# Altium schematic sheet Sheet1.SchDoc
size A2
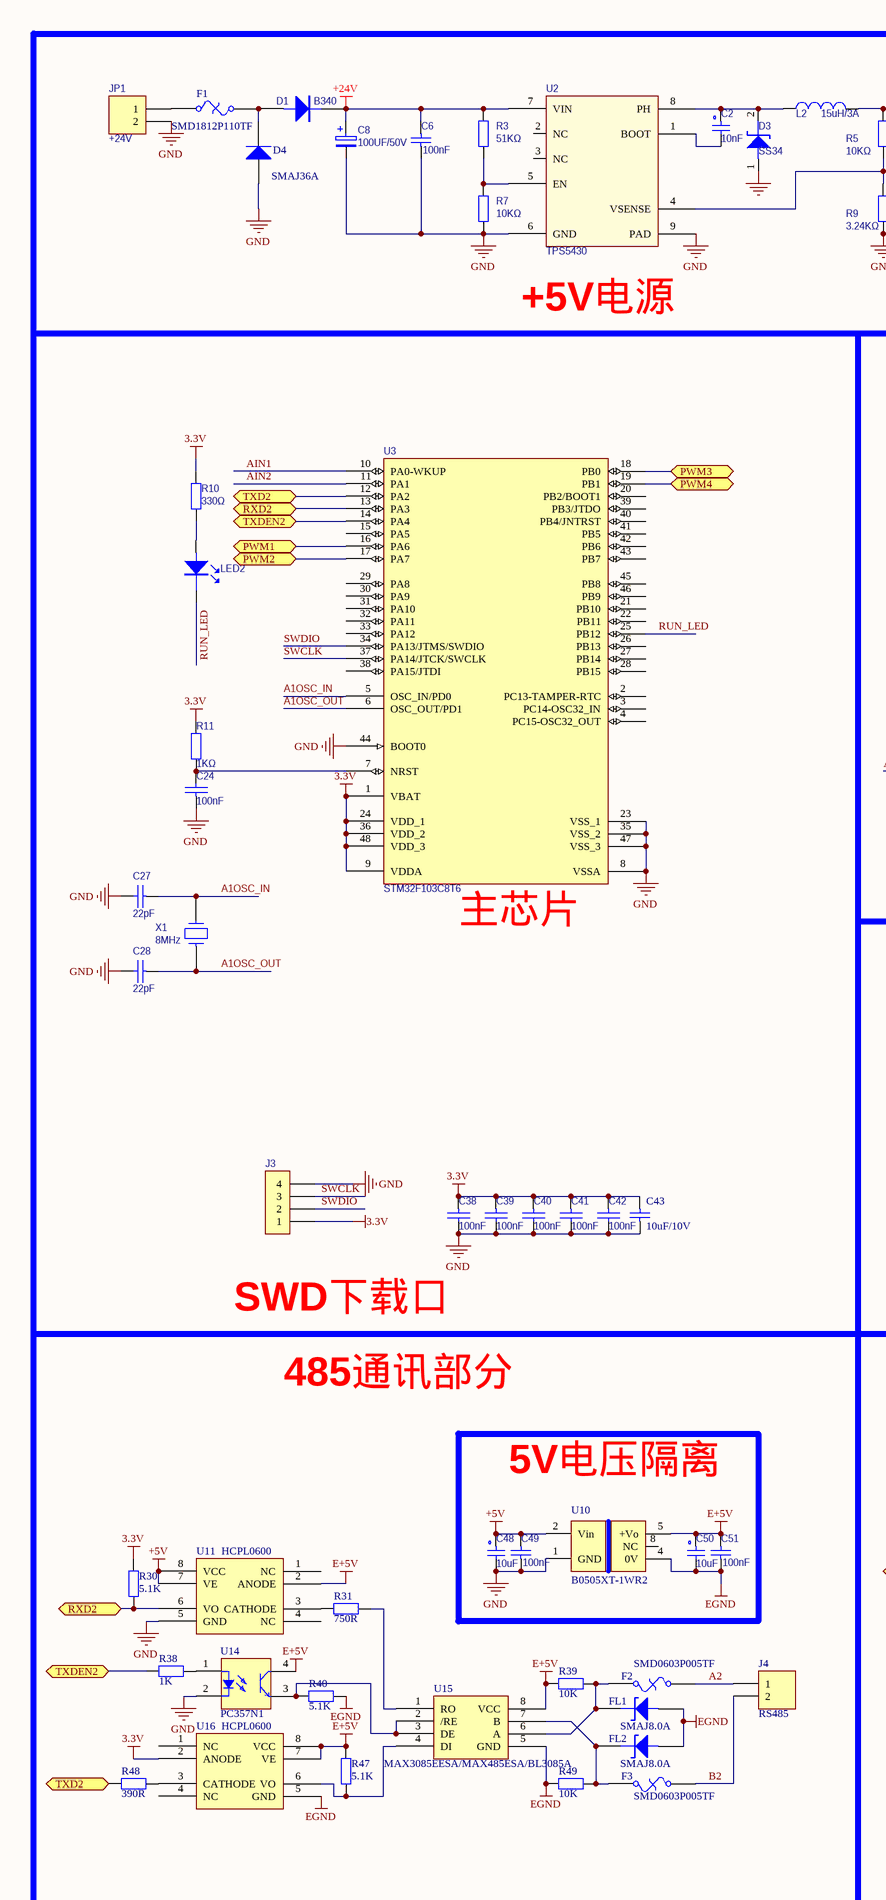
[diagram p0: Sheet1.SchDoc, left]
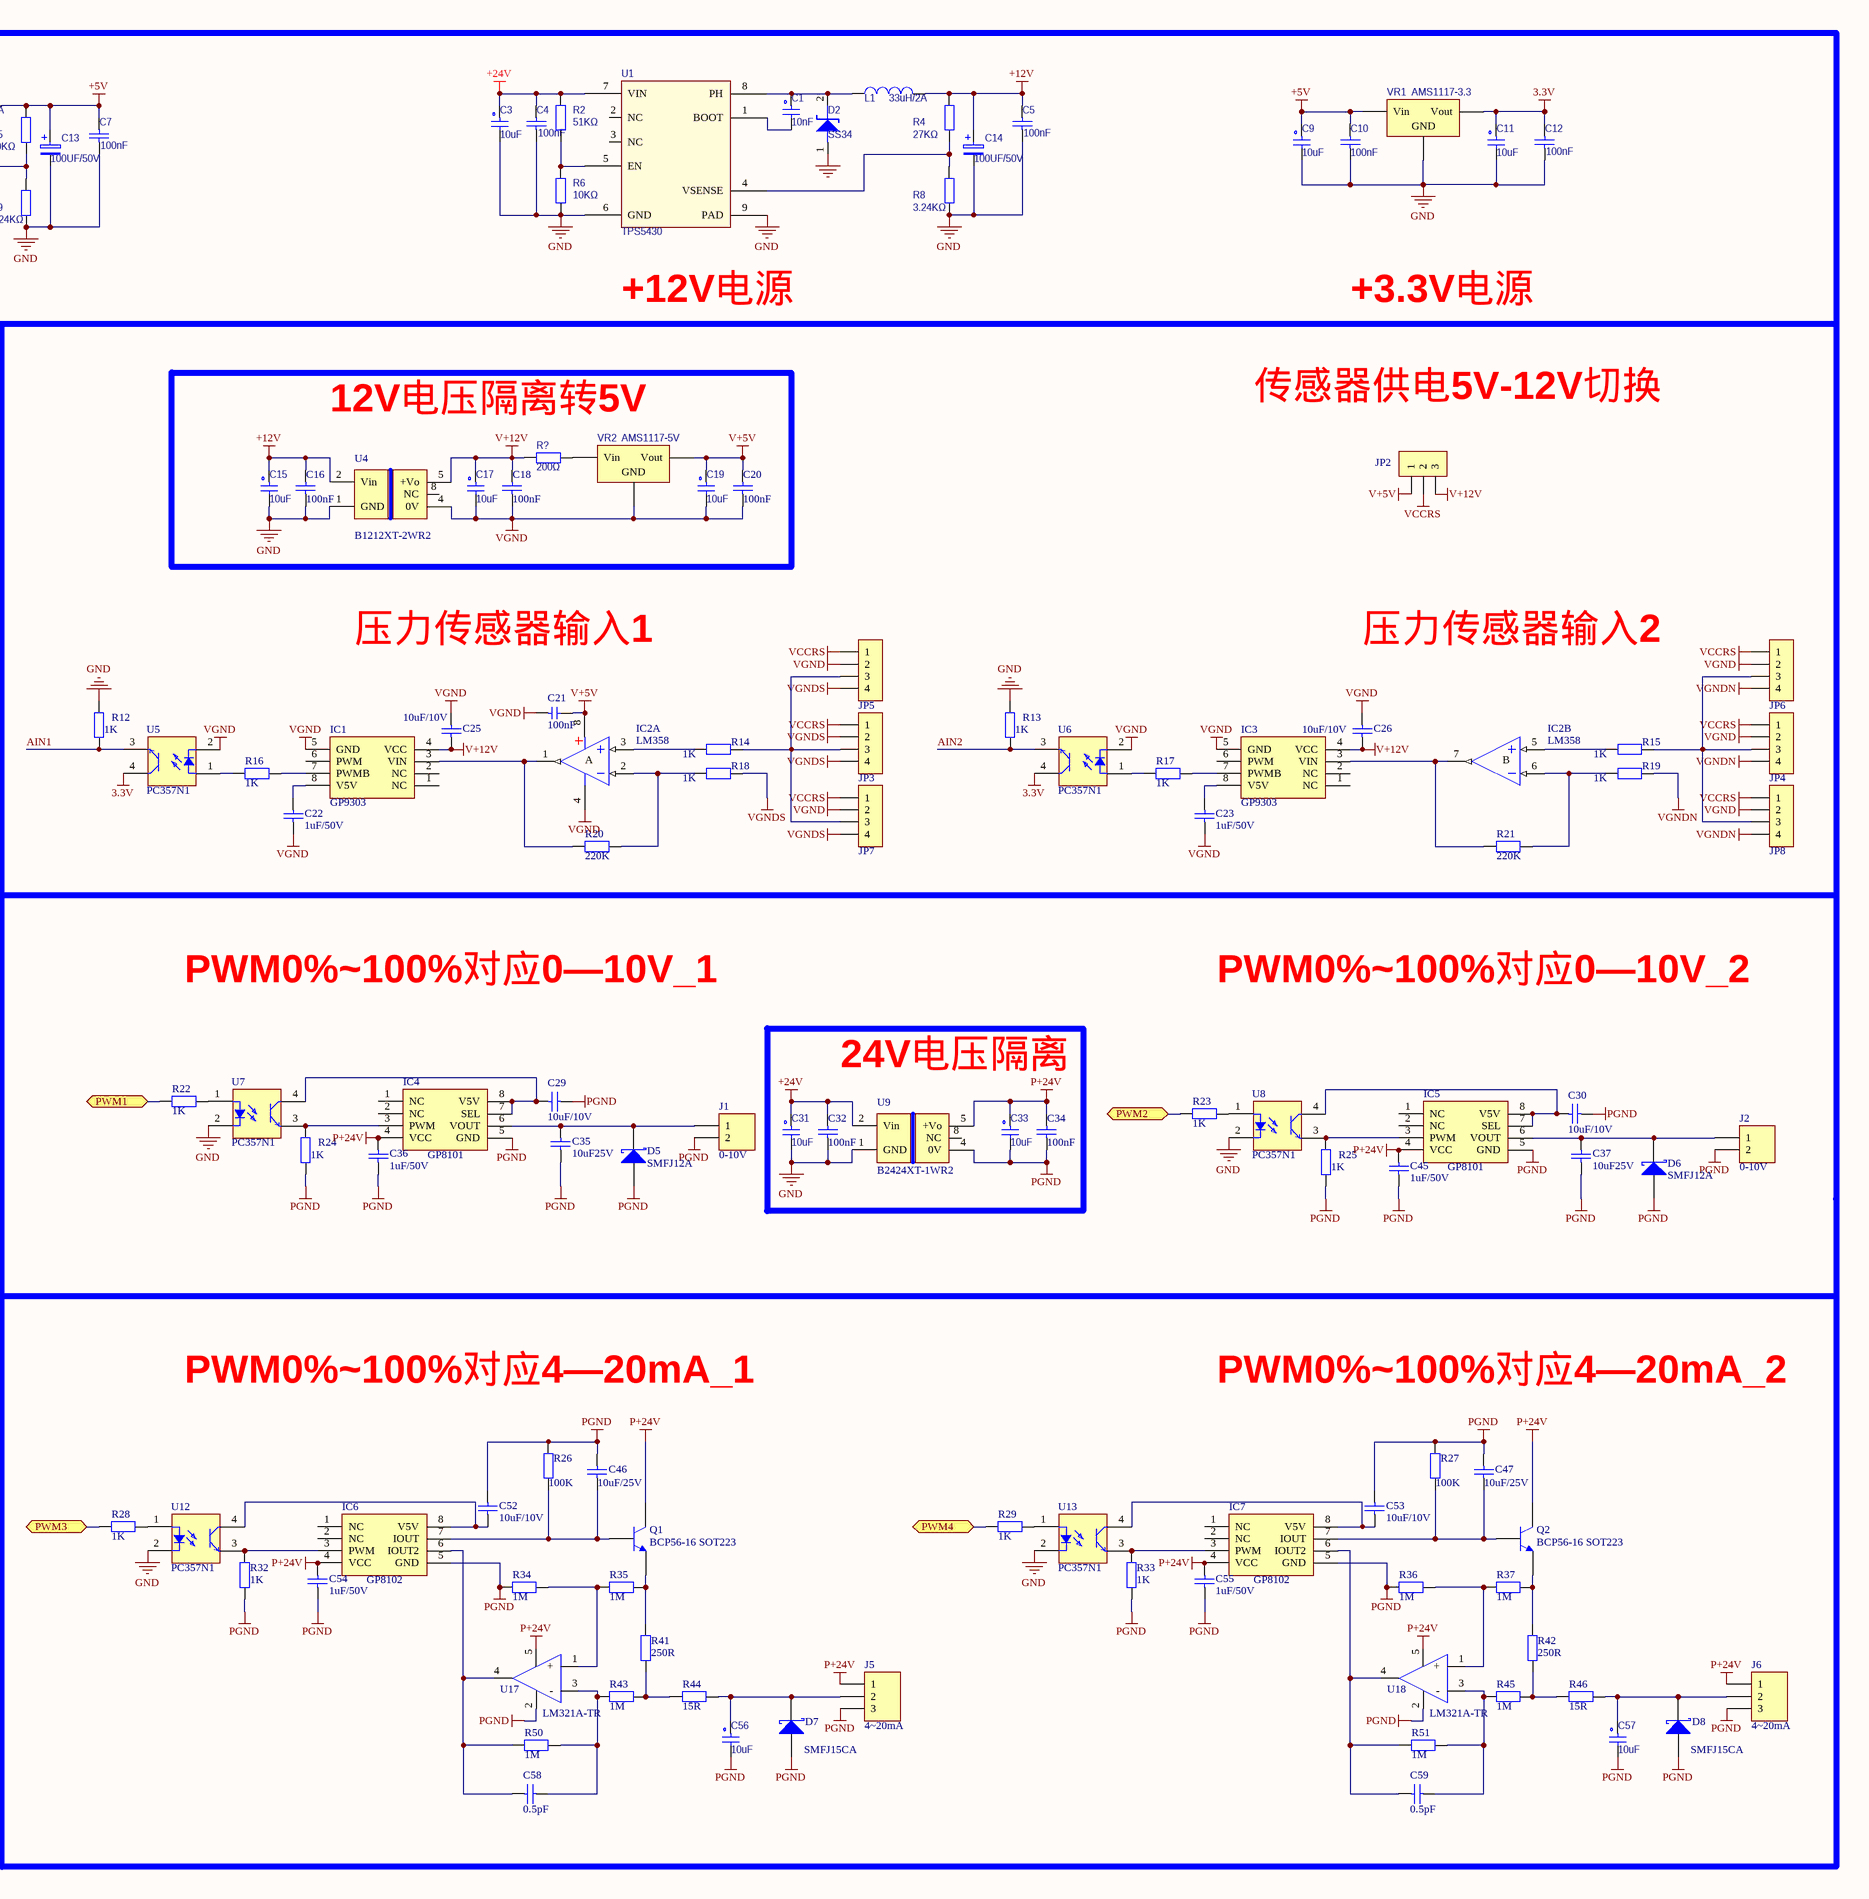
[diagram p1: Sheet1.SchDoc, right]

## Parts
C1  10nF  [SC0603]
C2  10nF  [SC0603]
C3  10uF  [C 1206_M]
C4  100nF  [C 0603_M]
C5  100nF  [C 0603_M]
C6  100nF  [C 0603_M]
C7  100nF  [C 0603_M]
C8  100UF/50V  [CM E(8*10.2)]
C9  10uF  [C 1206_M]
C10  100nF  [C 0603_M]
C11  10uF  [C 1206_M]
C12  100nF  [C 0603_M]
C13  100UF/50V  [CM E(8*10.2)]
C14  100UF/50V  [CM E(8*10.2)]
C15  10uF  [C 1206_M]
C16  100nF  [C 0603_M]
C17  10uF  [C 1206_M]
C18  100nF  [C 0603_M]
C19  10uF  [C 1206_M]
C20  100nF  [C 0603_M]
C21  100nF  [C 0603_M]
C22  1uF/50V  [C 0603_M]
C23  1uF/50V  [C 0603_M]
C24  100nF  [C 0603_M]
C25  10uF/10V  [C 0603_M]
C26  10uF/10V  [C 0603_M]
C27  22pF  [C 0603_M]
C28  22pF  [C 0603_M]
C29  10uF/10V  [C 0603_M]
C30  10uF/10V  [C 0603_M]
C31  10uF  [C 1206_M]
C32  100nF  [C 0603_M]
C33  10uF  [C 1206_M]
C34  100nF  [C 0603_M]
C35  10uF25V  [C 0603_M]
C36  1uF/50V  [C 0603_M]
C37  10uF25V  [C 0603_M]
C38  100nF  [C 0603_M]
C39  100nF  [C 0603_M]
C40  100nF  [C 0603_M]
C41  100nF  [C 0603_M]
C42  100nF  [C 0603_M]
C43  10uF/10V  [C 0603_M]
C45  1uF/50V  [C 0603_M]
C46  10uF/25V  [C 0603_M]
C47  10uF/25V  [C 0603_M]
C48  10uF  [C 1206_M]
C49  100nF  [C 0603_M]
C50  10uF  [C 1206_M]
C51  100nF  [C 0603_M]
C52  10uF/10V  [C 0603_M]
C53  10uF/10V  [C 0603_M]
C54  1uF/50V  [C 0603_M]
C55  1uF/50V  [C 0603_M]
C56  10uF  [C 1206_M]
C57  10uF  [C 1206_M]
C58  0.5pF  [C 0603_M]
C59  0.5pF  [C 0603_M]
D1  B340  [sma]
D2  SS34  [sma]
D3  SS34  [sma]
D4  SMAJ36A  [SMA]
D5  SMFJ12A  [SOD-123]
D6  SMFJ12A  [SOD-123]
D7  SMFJ15CA  [SOD-123]
D8  SMFJ15CA  [SOD-123]
F1  SMD1812P110TF  [L 1812]
F2  SMD0603P005TF  [R 0603_M]
F3  SMD0603P005TF  [R 0603_M]
FL1  SMAJ8.0A  [SMA]
FL2  SMAJ8.0A  [SMA]
IC1  GP9303  [SOP8_N]
IC2  LM358  [SOP8]  (parts A,B of 2)
IC3  GP9303  [SOP8_N]
IC4  GP8101  [SOP8_N]
IC5  GP8101  [SOP8_N]
IC6  GP8102  [SOP8_N]
IC7  GP8102  [SOP8_N]
J1  0-10V  [KF128-5.08-2P]
J2  0-10V  [KF128-5.08-2P]
J3  swio  [HDR2.54-LI-4P]  (value not drawn)
J4  RS485  [KF128-5.08-2P]
J5  4~20mA  [KF128-5.08-3P]
J6  4~20mA  [KF128-5.08-3P]
JP1  +24V  [KF128-5.08-2P]
JP2  HDR-1X3  [HDR2.54-LI-3P]  (value not drawn)
JP3  HDR-1X4  [KF128-5.08-4P]  (value not drawn)
JP4  HDR-1X4  [KF128-5.08-4P]  (value not drawn)
JP5  HDR-1X4  [KF128-5.08-4P]  (value not drawn)
JP6  HDR-1X4  [KF128-5.08-4P]  (value not drawn)
JP7  HDR-1X4  [KF128-5.08-4P]  (value not drawn)
JP8  HDR-1X4  [KF128-5.08-4P]  (value not drawn)
L1  33uH/2A  [CDRH74]
L2  15uH/3A  [CDRH74]
LED2  LED  [sled0603]  (value not drawn)
Q1  BCP56-16 SOT223  [SOT223_M]
Q2  BCP56-16 SOT223  [SOT223_M]
R2  51KΩ  [R 0603_M]
R3  51KΩ  [R 0603_M]
R4  27KΩ  [R 0603_M]
R5  10KΩ  [R 0603_M]
R6  10KΩ  [R 0603_M]
R7  10KΩ  [R 0603_M]
R8  3.24KΩ  [R 0603_M]
R9  3.24KΩ  [R 0603_M]
R10  330Ω  [R 0603_M]
R11  1KΩ  [R 0603_M]
R12  1K  [R 0603_M]
R13  1K  [R 0603_M]
R14  1K  [R 0603_M]
R15  1K  [R 0603_M]
R16  1K  [R 0603_M]
R17  1K  [R 0603_M]
R18  1K  [R 0603_M]
R19  1K  [R 0603_M]
R20  220K  [R 0603_M]
R21  220K  [R 0603_M]
R22  1K  [R 0603_M]
R23  1K  [R 0603_M]
R24  1K  [R 0603_M]
R25  1K  [R 0603_M]
R26  100K  [R 0603_M]
R27  100K  [R 0603_M]
R28  1K  [R 0603_M]
R29  1K  [R 0603_M]
R30  5.1K  [R 0603_M]
R31  750R  [R 0603_M]
R32  1K  [R 0603_M]
R33  1K  [R 0603_M]
R34  1M  [R 0603_M]
R35  1M  [R 0603_M]
R36  1M  [R 0603_M]
R37  1M  [R 0603_M]
R38  1K  [R 0603_M]
R39  10K  [R 0603_M]
R40  5.1K  [R 0603_M]
R41  250R  [R 0603_M]
R42  250R  [R 0603_M]
R43  1M  [R 0603_M]
R44  15R  [R 0603_M]
R45  1M  [R 0603_M]
R46  15R  [R 0603_M]
R47  5.1K  [R 0603_M]
R48  390R  [R 0603_M]
R49  10K  [R 0603_M]
R50  1M  [R 0603_M]
R51  1M  [R 0603_M]
R?  200Ω  [R 1206_M]
U1  TPS5430  [SOP127P780-9]
U2  TPS5430  [SOP127P780-9]
U3  STM32F103C8T6  [LQFP48 7X7_M]
U4  B1212XT-2WR2  [B_XT-1W]
U5  PC357N1  [SOP4_M]
U6  PC357N1  [SOP4_M]
U7  PC357N1  [SOP4_M]
U8  PC357N1  [SOP4_M]
U9  B2424XT-1WR2  [B_XT-1W]
U10  B0505XT-1WR2  [B_XT-1W]
U11  HCPL0600  [SO-8]
U12  PC357N1  [SOP4_M]
U13  PC357N1  [SOP4_M]
U14  PC357N1  [SOP4_M]
U15  MAX3085EESA/MAX485ESA/BL3085A  [SO-8]
U16  HCPL0600  [SO-8]
U17  LM321A-TR  [SOT23-5]
U18  LM321A-TR  [SOT23-5]
VR1  AMS1117-3.3  [SOT-223-4]
VR2  AMS1117-5V  [SOT-223-4]
X1  8MHz  [OSC HC-49SMD]

## Blocks framed on the sheet
12V电压隔离转5V: C15-C20 R? U4 VR2
24V电压隔离: C31-C34 U9

## Ports
PWM1 (bidir), PWM2 (bidir), PWM3 (bidir), PWM4 (bidir), RXD2 (bidir), TXD2 (bidir), TXDEN2 (bidir)

## Nets
3.3V: C11.1 C12.2 C38.1 C39.1 C40.1 C41.1 C42.1 C43.2 J3.1 R10.1 R11.2 R30.2 U3.1(VBAT) U3.9(VDDA) U3.24(VDD_1) U3.36(VDD_2) U3.48(VDD_3) U5.4 U6.4 U16.2(ANODE) VR1.2(Vout)
+5V: C7.2 C9.1 C10.2 C13.1 C48.1 C49.2 L2.2 R5.2 U10.2(Vin) U11.7(VE) U11.8(VCC) VR1.3(Vin)
+12V: C5.2 C14.1 C15.1 C16.2 L1.2 R4.2 U4.2(Vin)
+24V: C3.1 C4.2 C6.2 C8.1 C31.1 C32.2 D1.2 R2.2 R3.2 U1.7(VIN) U2.7(VIN) U9.2(Vin)
E+5V: C50.1 C51.2 R39.2 R47.2 U10.5(+Vo) U11.2(ANODE) U14.4 U15.8(VCC) U16.7(VE) U16.8(VCC)
EGND: C50.2 C51.1 FL1.1(A) FL2.1(A) R40.2 R49.2 U10.4(0V) U15.5(GND) U16.5(GND)
GND: C3.2 C4.1 C5.1 C6.1 C7.1 C8.2 C9.2 C10.1 C11.2 C12.1 C13.2 C14.2 C15.2 C16.1 C24.1 C27.2 C28.2 C31.2 C32.1 C38.2 C39.2 C40.2 C41.2 C42.2 C43.1 C48.2 C49.1 D2.1(A) D3.1(A) D4.1(A) J3.4 JP1.2 R6.1 R7.1 R8.1 R9.1 R12.1 R13.1 U1.6(GND) U1.9(PAD) U2.6(GND) U2.9(PAD) U3.8(VSSA) U3.23(VSS_1) U3.35(VSS_2) U3.44(BOOT0) U3.47(VSS_3) U4.1(GND) U7.2 U8.2 U9.1(GND) U10.1(GND) U11.5(GND) U12.2 U13.2 U14.2 VR1.1(GND)
P+24V: C33.1 C34.2 C36.2 C45.2 C54.2 C55.2 IC4.4(VCC) IC5.4(VCC) IC6.4(VCC) IC7.4(VCC) J5.1 J6.1 Q1.2 Q2.2 U9.5(+Vo) U17.5(V+) U18.5(V+)
PGND: C29.2 C30.2 C33.2 C34.1 C35.1 C36.1 C37.1 C45.1 C46.2 C47.2 C52.2 C53.2 C54.1 C55.1 C56.2 C57.2 D5.1(A) D6.1(A) D7.1(A) D8.1(A) IC4.5(GND) IC5.5(GND) IC6.5(GND) IC7.5(GND) J1.2 J2.2 J5.3 J6.3 R24.2 R25.2 R26.1 R27.1 R32.2 R33.2 R34.1 R36.1 U9.4(0V) U17.2(VS-) U18.2(VS-)
V+5V: C19.1 C20.2 C21.2 IC2.8(V+) JP2.1 VR2.2(Vout)
V+12V: C17.1 C18.2 C25.1 C26.1 IC1.4(VCC) IC3.4(VCC) JP2.3 R?.2 U4.5(+Vo)
VCCRS: JP2.2 JP3.1 JP4.1 JP5.1 JP6.1 JP7.1 JP8.1
VGND: C17.2 C18.1 C19.2 C20.1 C21.1 C22.2 C23.1 C25.2 C26.2 IC1.5(GND) IC2.4(V-) IC3.5(GND) JP4.2 JP5.2 JP6.2 JP7.2 JP8.2 U4.4(0V) U5.2 U6.2 VR2.1(GND)
VGNDN: JP4.4 JP6.4 JP8.4 R19.2
VGNDS: JP3.2 JP3.4 JP5.4 JP7.4 R18.2
A1OSC_IN: C27.1 U3.5(OSC_IN/PD0) X1.2
A1OSC_OUT: C28.1 U3.6(OSC_OUT/PD1) X1.1
A2: F2.1 J4.1
AIN1: R12.2 U3.10(PA0-WKUP) U5.3
AIN2: R13.2 U3.11(PA1) U6.3
B2: F3.1 J4.2
PWM1: R22.1 U3.16(PA6) ; port PWM1
PWM2: R23.1 U3.17(PA7) ; port PWM2
PWM3: R28.1 U3.18(PB0) ; port PWM3
PWM4: R29.1 U3.19(PB1) ; port PWM4
RUN_LED: LED2.2 U3.25(PB12)
RXD2: R30.1 U3.13(PA3) U11.6(VO) ; port RXD2
SWCLK: J3.3 U3.37(PA14/JTCK/SWCLK)
SWDIO: J3.2 U3.34(PA13/JTMS/SWDIO)
TXD2: R48.1 U3.12(PA2) ; port TXD2
TXDEN2: R38.1 U3.14(PA4) ; port TXDEN2
NetC1_1: C1.1 D2.2(K) L1.1 U1.8(PH)
NetC1_2: C1.2 U1.1(BOOT)
NetC2_1: C2.1 D3.2(K) L2.1 U2.8(PH)
NetC2_2: C2.2 U2.1(BOOT)
NetC22_1: C22.1 IC1.8(V5V)
NetC23_2: C23.2 IC3.8(V5V)
NetC24_2: C24.2 R11.1 U3.7(NRST)
NetC29_1: C29.1 IC4.7(SEL) IC4.8(V5V) U7.4
NetC30_1: C30.1 IC5.7(SEL) IC5.8(V5V) U8.4
NetC35_2: C35.2 D5.2(K) IC4.6(VOUT) J1.1
NetC37_2: C37.2 D6.2(K) IC5.6(VOUT) J2.1
NetC46_1: C46.1 IC6.7(IOUT) Q1.1 R26.2
NetC47_1: C47.1 IC7.7(IOUT) Q2.1 R27.2
NetC52_1: C52.1 IC6.8(V5V) U12.4
NetC53_1: C53.1 IC7.8(V5V) U13.4
NetC56_1: C56.1 D7.2(K) J5.2 R44.1
NetC57_1: C57.1 D8.2(K) J6.2 R46.1
NetC58_1: C58.1 R43.2 R50.1 U17.3(-)
NetC58_2: C58.2 IC6.6(IOUT2) R50.2 U17.4(OUTA)
NetC59_1: C59.1 R45.2 R51.1 U18.3(-)
NetC59_2: C59.2 IC7.6(IOUT2) R51.2 U18.4(OUTA)
NetD1_1: D1.1 D4.2(K) F1.1
NetF1_2: F1.2 JP1.1
NetF2_2: F2.2 FL1.2(K) R39.1 U15.6(A)
NetF3_2: F3.2 FL2.2(K) R49.1 U15.7(B)
NetIC1_3: IC1.3(VIN) IC2.1(OUT) R20.1
NetIC1_7: IC1.7(PWMB) R16.2
NetIC2_2: IC2.2(IN-) R18.1 R20.2
NetIC2_3: IC2.3(IN+) R14.1
NetIC2_5: IC2.5(IN+) R15.1
NetIC2_6: IC2.6(IN-) R19.1 R21.2
NetIC2_7: IC2.7(OUT) IC3.3(VIN) R21.1
NetIC3_7: IC3.7(PWMB) R17.2
NetIC4_3: IC4.3(PWM) R24.1 U7.3
NetIC5_3: IC5.3(PWM) R25.1 U8.3
NetIC6_3: IC6.3(PWM) R32.1 U12.3
NetIC7_3: IC7.3(PWM) R33.1 U13.3
NetJP3_3: JP3.3 JP5.3 JP7.3 R14.2
NetJP4_3: JP4.3 JP6.3 JP8.3 R15.2
NetLED2_1: LED2.1 R10.2
NetQ1_3: Q1.3 R35.2 R41.2
NetQ2_3: Q2.3 R37.2 R42.2
NetR2_1: R2.1 R6.2 U1.5(EN)
NetR3_1: R3.1 R7.2 U2.5(EN)
NetR4_1: R4.1 R8.2 U1.4(VSENSE)
NetR5_1: R5.1 R9.2 U2.4(VSENSE)
NetR16_1: R16.1 U5.1
NetR17_1: R17.1 U6.1
NetR22_2: R22.2 U7.1
NetR23_2: R23.2 U8.1
NetR28_2: R28.2 U12.1
NetR29_2: R29.2 U13.1
NetR31_1: R31.1 U11.3(CATHODE)
NetR31_2: R31.2 U15.1(RO)
NetR34_2: R34.2 R35.1 U17.1(+)
NetR36_2: R36.2 R37.1 U18.1(+)
NetR38_2: R38.2 U14.1
NetR40_1: R40.1 U14.3 U15.2(/RE) U15.3(DE)
NetR41_1: R41.1 R43.1 R44.2
NetR42_1: R42.1 R45.1 R46.2
NetR47_1: R47.1 U15.4(DI) U16.6(VO)
NetR48_2: R48.2 U16.3(CATHODE)
NetR?_1: R?.1 VR2.3(Vin)

Not connected (* = marked no-connect by the designer): IC1 1(NC) 2(NC) 6(PWM); IC3 1(NC) 2(NC) 6(PWM); IC4 1(NC) 2(NC); IC5 1(NC) 2(NC); IC6 1(NC) 2(NC); IC7 1(NC) 2(NC); U1 2(NC) 3(NC); U2 2(NC) 3(NC); U3 2(PC13-TAMPER-RTC) 3(PC14-OSC32_IN) 4(PC15-OSC32_OUT) 15(PA5) 20(PB2/BOOT1) 21(PB10) 22(PB11) 26(PB13) 27(PB14) 28(PB15) 29(PA8) 30(PA9) 31(PA10) 32(PA11) 33(PA12) 38(PA15/JTDI) 39(PB3/JTDO) 40(PB4/JNTRST) 41(PB5) 42(PB6) 43(PB7) 45(PB8) 46(PB9); U4 8(NC); U9 8(NC); U10 8(NC); U11 1(NC) 4(NC); U16 1(NC) 4(NC)

## Notes on the sheet
- +5V电源
- +12V电源
- +3.3V电源
- 传感器供电5V-12V切换
- 压力传感器输入1
- 压力传感器输入2
- (near U3) 主芯片
- PWM0%~100%对应0—10V_1
- PWM0%~100%对应0—10V_2
- SWD下载口
- 485通讯部分
- 5V电压隔离
- PWM0%~100%对应4—20mA_1
- PWM0%~100%对应4—20mA_2
- (in symbol LM358, part A) A
- (in symbol LM358, part B) B

## Library data of the parts
C1-C3 C9 C11 C15 C17 C19 C24 C27 C28 C31 C33 C38-C42 C48 C50 C56 C57 = CAP: Capacitor
C4-C7 C10 C12 C49 C51 = 0603 100nF (104) 10% 50V: 贴片电容; ComponentLink1Description: 供应商链接; ComponentLink1URL: http://www.szlcsc.com/product/details_15331.html; Package: 0603; Supplier: LC; SuppliersPartNumber: C14663
C8 C13 C14 = E1: Electro capacitor
C16 C18 C20 C22 C23 C25 C26 C29 C30 C32 C34-C37 C43 C45-C47 C52-C55 C58 C59 = Cap Semi: Capacitor (Semiconductor SIM Model); Published: 8-Jun-2000; LatestRevisionDate: 17-Jul-2002; LatestRevisionNote: Re-released for DXP Platform.; PackageReference: C1206; Publisher: Altium Limited
C21 = C
D1 = DIODE
D2 D3 FL1 FL2 = ZENER2: Zener Diode
D4 = Diode-GYT: 普通二极管
D5 D6 = D Schottky: SMFJ15CA; Published: 8-Jun-2000; LatestRevisionDate: 17-Jul-2002; LatestRevisionNote: Re-released for DXP Platform.; PackageReference: SMB; Publisher: Altium Limited; PackageDescription: DO-214-AA/SMB; 2 C-Bend Leads; Body 5.3 x 3.6 mm, inc. leads (LxW); Code_JEDEC: DO-214-AA
D7 D8 = D Schottky: Published: 8-Jun-2000; LatestRevisionDate: 17-Jul-2002; LatestRevisionNote: Re-released for DXP Platform.; PackageReference: SMB; Publisher: Altium Limited; PackageDescription: DO-214-AA/SMB; 2 C-Bend Leads; Body 5.3 x 3.6 mm, inc. leads (LxW); Code_JEDEC: DO-214-AA
F1-F3 = Fuse Thermal: Thermal Fuse; Published: 24-Mar-1999; LatestRevisionDate: 17-Jul-2002; LatestRevisionNote: Re-released for DXP Platform.; PackageReference: PIN-W2/E2.8
  F1: Publisher: 200mA
  F2 F3: Publisher: 50mA
IC1 IC3 = GP9303: BOM名称: K型热电偶检测芯片; 版权归属: 源创客; 学习资源: www.ooocke.com
IC2 = LM358: 双路运放; 版权归属: 源创客; BOM名称: 双路运放; 学习资源: www.ooocke.com
IC4 IC5 = GP8101: BOM名称: K型热电偶检测芯片; 版权归属: 源创客; 学习资源: www.ooocke.com
IC6 IC7 = GP8102: BOM名称: K型热电偶检测芯片; 版权归属: 源创客; 学习资源: www.ooocke.com
J1 J2 J4 JP1 = Header 2: Header, 2-Pin; LatestRevisionDate: 17-Jul-2002; LatestRevisionNote: Re-released for DXP Platform.; Publisher: Altium Limited
J3 = HDR1x4: Connector
J5 J6 = Header 3: Header, 3-Pin; LatestRevisionDate: 17-Jul-2002; LatestRevisionNote: Re-released for DXP Platform.; Publisher: Altium Limited
JP2 = Header 3: 3P接插件; 版权归属: 源创客; BOM名称: 3P接插件; 学习资源: www.ooocke.com
JP3-JP8 = Header 4: 4P接插件; 版权归属: 源创客; BOM名称: 4P接插件; 学习资源: www.ooocke.com
L1 L2 = INDUCTOR
LED2 = LED0805
Q1 Q2 = NPN_SOT223
R2-R9 R11-R51 R? = Res2: Resistor
  R12-R51: Published: 8-Jun-2000; LatestRevisionDate: 17-Jul-2002; LatestRevisionNote: Re-released for DXP Platform.; PackageReference: AXIAL-0.4; Publisher: Altium Limited
R10 = 0603 1KΩ (1001) 1%: 贴片电阻; ComponentLink1Description: 供应商链接; ComponentLink1URL: http://www.szlcsc.com/product/details_21904.html; Package: 0603; Supplier: LC; SuppliersPartNumber: C21190
U1 U2 = TPS5430: 3-A, Wide Input Range, Step-Down Converter
U3 = STM32F103CBT6: STM32 ARM-based 32-bit MCU with 128 Kbytes Flash, 48-pin LQFP, Industrial Temperature; Published: 30-May-2008; DatasheetVersion: rev6, Mar-2008; PackageVersion: Mar-2008; PackageReference: LQFP48; Publisher: Altium Limited; PackageDescription: 48-Pin Low-Profile Quad Flat Pack, 7 x 7 mm Body, 0.5 mm Pitch (LQFP48); ComponentLink1Description: Manufacturer Link; ComponentLink1URL: www.st.com/stm32; ComponentLink2Description: Datasheet; ComponentLink2URL: http://www.st.com/stonline/products/literature/ds/13587.pdf
U4 U9 U10 = B_XT-1W
U5-U8 U12-U14 = TLP521-1
U11 U16 = 6N137
U15 = MAX485
U17 U18 = LM321: LM321 SOT23-5
VR1 VR2 = SOT-223 AMS1117-3.3: 低压差线性稳压(LDO); ComponentLink1Description: 供应商链接; ComponentLink1URL: http://www.szlcsc.com/product/details_6652.html; Package: SOT-223; Supplier: LC; SuppliersPartNumber: C6186
X1 = CRYSTAL